# Altium project keycontrol.PrjPCB
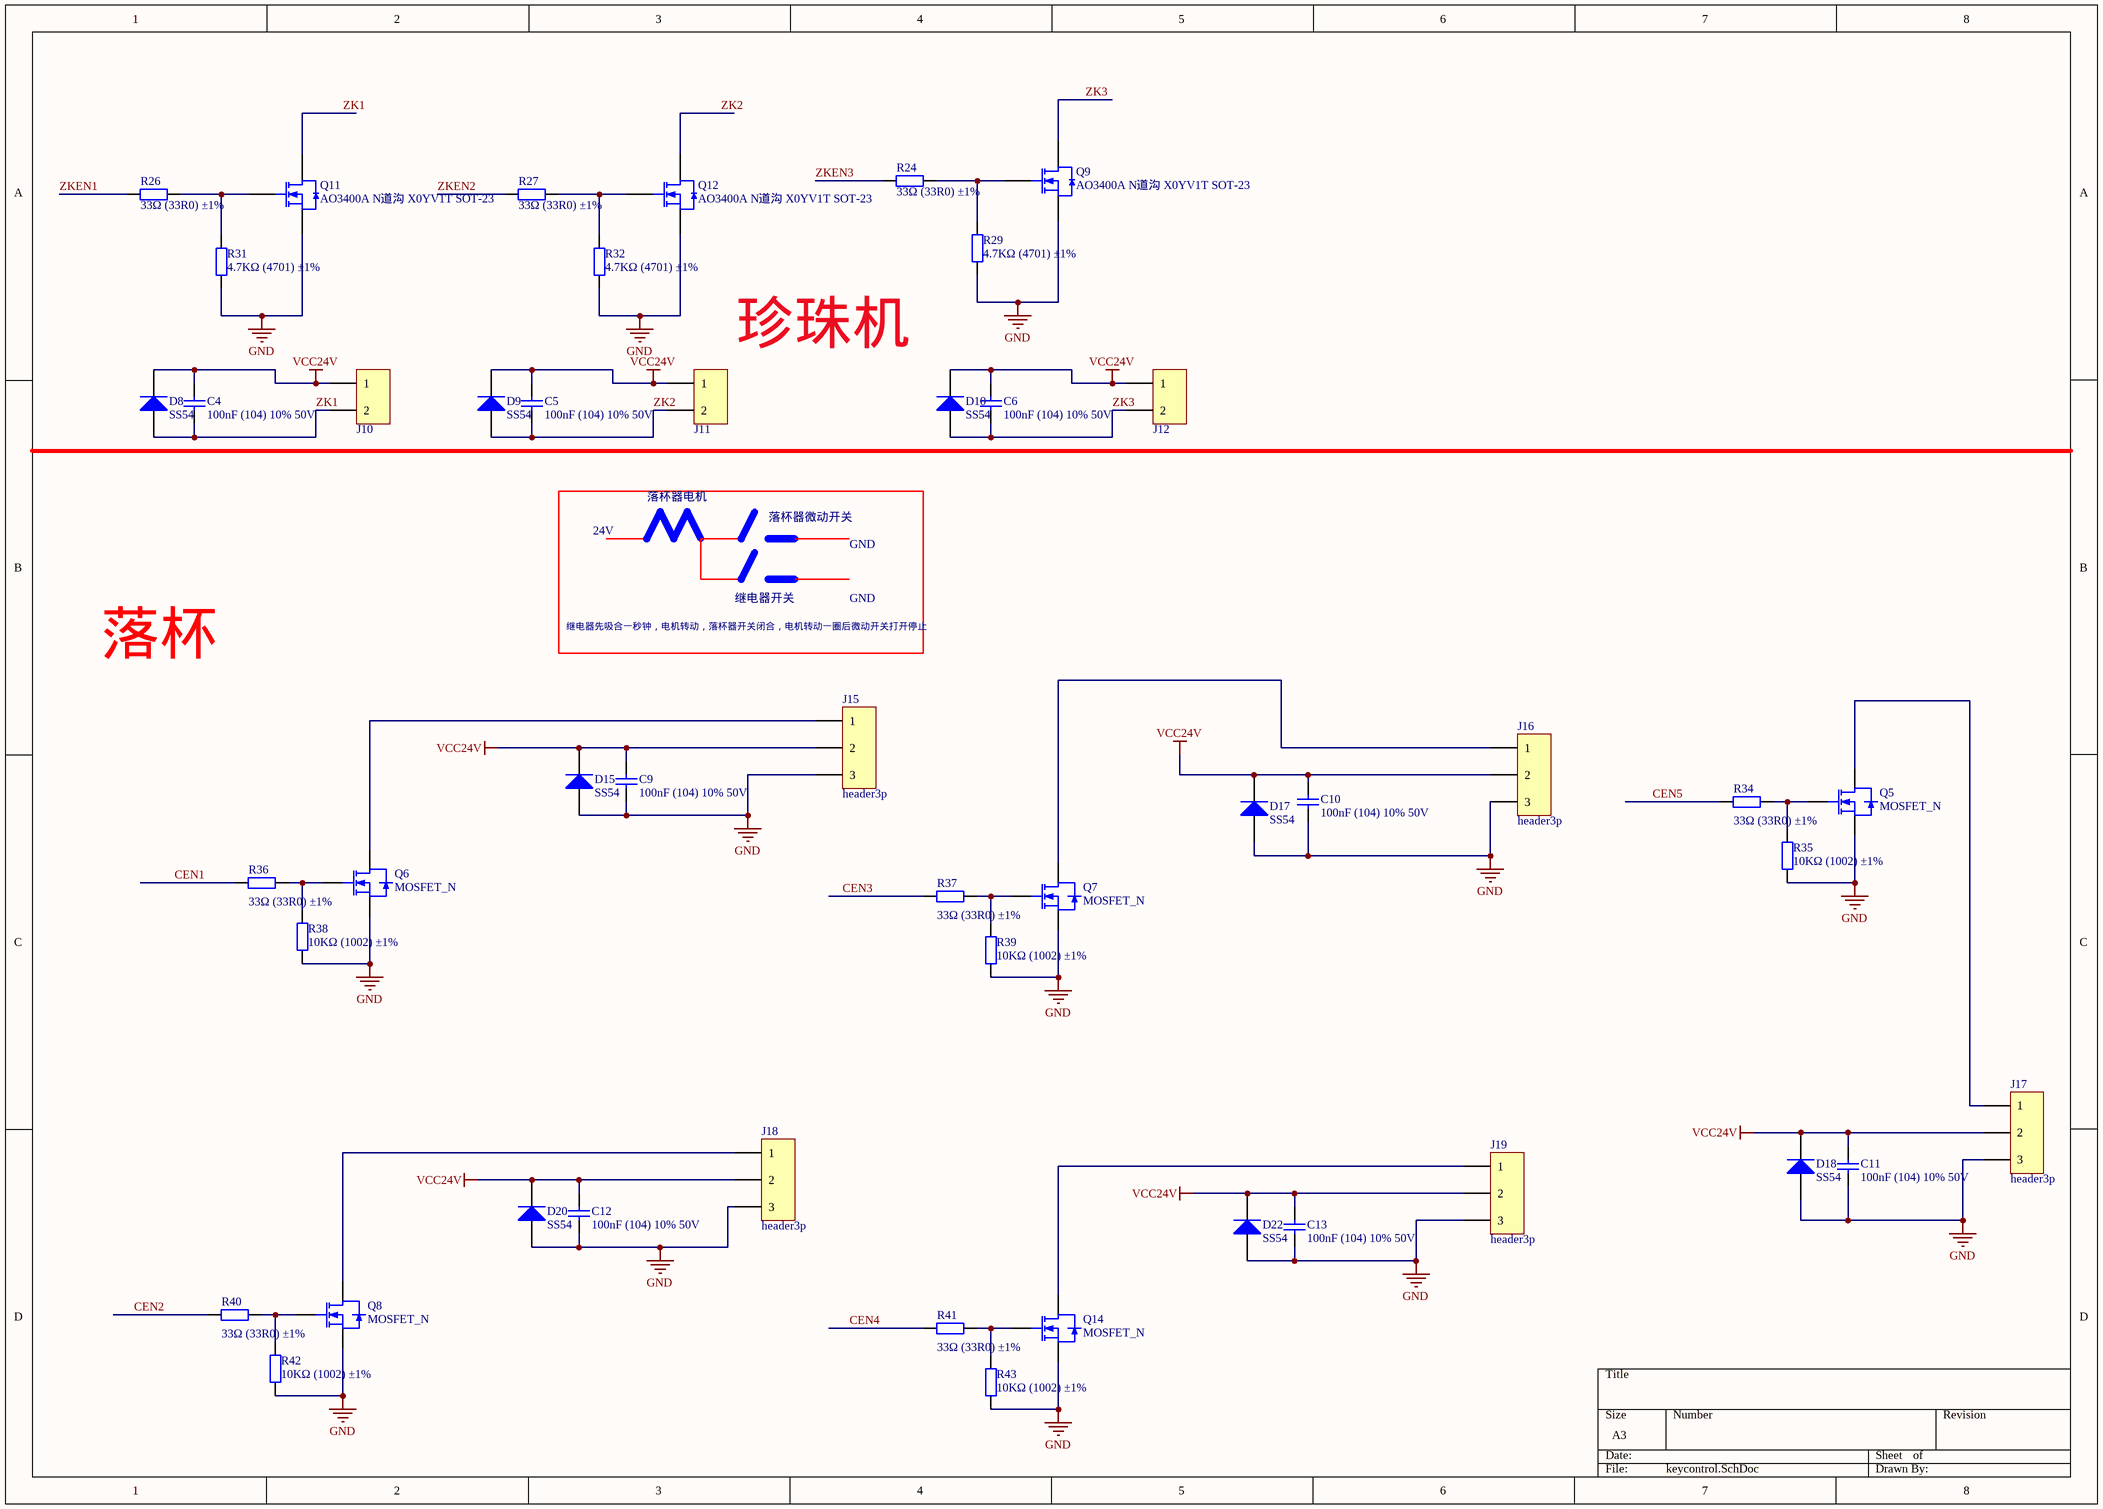
[diagram p0: keycontrol.SchDoc]
4 sheets, 147 parts. Net scope: global (net labels, ports and power ports of the same name join across sheets).
Board file: keycontrol.PcbDoc
Sheets:
  keycontrol.SchDoc
  keycontrol1.SchDoc
  keycontrol2.SchDoc
  keycontrol_MCU.SchDoc

## Sheet keycontrol.SchDoc
size A3

### Parts
C4  100nF (104) 10% 50V  [0603_C]
C5  100nF (104) 10% 50V  [0603_C]
C6  100nF (104) 10% 50V  [0603_C]
C9  100nF (104) 10% 50V  [0603_C]
C10  100nF (104) 10% 50V  [0603_C]
C11  100nF (104) 10% 50V  [0603_C]
C12  100nF (104) 10% 50V  [0603_C]
C13  100nF (104) 10% 50V  [0603_C]
D8  SS54  [SMA(DO-214AC)_S1]
D9  SS54  [SMA(DO-214AC)_S1]
D10  SS54  [SMA(DO-214AC)_S1]
D15  SS54  [SMA(DO-214AC)_S1]
D17  SS54  [SMA(DO-214AC)_S1]
D18  SS54  [SMA(DO-214AC)_S1]
D20  SS54  [SMA(DO-214AC)_S1]
D22  SS54  [SMA(DO-214AC)_S1]
J10  MOTOR  [XH-2P]  (value not drawn)
J11  MOTOR  [XH-2P]  (value not drawn)
J12  MOTOR  [XH-2P]  (value not drawn)
J15  header3p  [XH-3]
J16  header3p  [XH-3]
J17  header3p  [XH-3]
J18  header3p  [XH-3]
J19  header3p  [XH-3]
Q5  MOSFET_N  [TO-252-2]
Q6  MOSFET_N  [TO-252-2]
Q7  MOSFET_N  [TO-252-2]
Q8  MOSFET_N  [TO-252-2]
Q9  AO3400A N道沟 X0YV1T SOT-23  [SOT-23-3L]
Q11  AO3400A N道沟 X0YV1T SOT-23  [SOT-23-3L]
Q12  AO3400A N道沟 X0YV1T SOT-23  [SOT-23-3L]
Q14  MOSFET_N  [TO-252-2]
R24  33Ω (33R0) ±1%  [0603_R]
R26  33Ω (33R0) ±1%  [0603_R]
R27  33Ω (33R0) ±1%  [0603_R]
R29  4.7KΩ (4701) ±1%  [0603_R]
R31  4.7KΩ (4701) ±1%  [0603_R]
R32  4.7KΩ (4701) ±1%  [0603_R]
R34  33Ω (33R0) ±1%  [0603_R]
R35  10KΩ (1002) ±1%  [0603_R]
R36  33Ω (33R0) ±1%  [0603_R]
R37  33Ω (33R0) ±1%  [0603_R]
R38  10KΩ (1002) ±1%  [0603_R]
R39  10KΩ (1002) ±1%  [0603_R]
R40  33Ω (33R0) ±1%  [0603_R]
R41  33Ω (33R0) ±1%  [0603_R]
R42  10KΩ (1002) ±1%  [0603_R]
R43  10KΩ (1002) ±1%  [0603_R]

### Nets
GND: C9.1 C10.1 C11.1 C12.1 C13.1 D15.1(A) D17.1(A) D18.1(A) D20.1(A) D22.1(A) J15.3 J16.3 J17.3 J18.3 J19.3 Q5.3(S) Q6.3(S) Q7.3(S) Q8.3(S) Q9.2(S) Q11.2(S) Q12.2(S) Q14.3(S) R29.1 R31.1 R32.1 R35.1 R38.1 R39.1 R42.1 R43.1
VCC24V: C4.2 C5.2 C6.2 C9.2 C10.2 C11.2 C12.2 C13.2 D8.2(K) D9.2(K) D10.2(K) D15.2(K) D17.2(K) D18.2(K) D20.2(K) D22.2(K) J10.1 J11.1 J12.1 J15.2 J16.2 J17.2 J18.2 J19.2
CEN1: R36.1
CEN2: R40.1
CEN3: R37.1
CEN4: R41.1
CEN5: R34.1
ZK1: C4.1 D8.1(A) J10.2 Q11.3(D)
ZK2: C5.1 D9.1(A) J11.2 Q12.3(D)
ZK3: C6.1 D10.1(A) J12.2 Q9.3(D)
ZKEN1: R26.1
ZKEN2: R27.1
ZKEN3: R24.1
NetJ15_1: J15.1 Q6.2(D)
NetJ16_1: J16.1 Q7.2(D)
NetJ17_1: J17.1 Q5.2(D)
NetJ18_1: J18.1 Q8.2(D)
NetJ19_1: J19.1 Q14.2(D)
NetQ5_1: Q5.1(G) R34.2 R35.2
NetQ6_1: Q6.1(G) R36.2 R38.2
NetQ7_1: Q7.1(G) R37.2 R39.2
NetQ8_1: Q8.1(G) R40.2 R42.2
NetQ9_1: Q9.1(G) R24.2 R29.2
NetQ11_1: Q11.1(G) R26.2 R31.2
NetQ12_1: Q12.1(G) R27.2 R32.2
NetQ14_1: Q14.1(G) R41.2 R43.2

### Notes on the sheet
- 珍珠机
- 落杯器电机
- 24V
- 落杯器微动开关
- GND
- 继电器先吸合一秒钟，电机转动，落杯器开关闭合，电机转动一圈后微动开关打开停止
- 继电器开关
- 落杯

### Library data of the parts
C4-C6 C9-C13 = 0603 100nF (104) 10% 50V: 贴片电容; ComponentLink1Description: 供应商链接; ComponentLink1URL: http://www.szlcsc.com/product/details_15331.html; Package: 0603; Supplier: LC; SuppliersPartNumber: C14663
D8-D10 D15 D17 D18 D20 D22 = SMA(DO-214AC) SS54: 二极管; ComponentLink1Description: 供应商链接; ComponentLink1URL: http://www.szlcsc.com/product/details_23178.html; Package: SMA(DO-214AC); Supplier: LC; SuppliersPartNumber: C22452
J10-J12 = header2
Q9 Q11 Q12 = AO3400A N道沟 X0YV1T SOT-23: MOS(场效应管); ComponentLink1Description: 供应商链接; ComponentLink1URL: http://www.szlcsc.com/product/details_21629.html; Package: SOT-23; Supplier: LC; SuppliersPartNumber: C20917
R24 R26 R27 R34 R36 R37 R40 R41 = 0603 33Ω (33R0) 1%: 贴片电阻; ComponentLink1Description: 供应商链接; ComponentLink1URL: http://www.szlcsc.com/product/details_23867.html; Package: 0603; Supplier: LC; SuppliersPartNumber: C23140
R29 R31 R32 = 0603 4.7KΩ (4701) 1%: 贴片电阻; ComponentLink1Description: 供应商链接; ComponentLink1URL: http://www.szlcsc.com/product/details_23889.html; Package: 0603; Supplier: LC; SuppliersPartNumber: C23162
R35 R38 R39 R42 R43 = 0603 10KΩ (1002) 1%: 贴片电阻; ComponentLink1Description: 供应商链接; ComponentLink1URL: http://www.szlcsc.com/product/details_26547.html; Package: 0603; Supplier: LC; SuppliersPartNumber: C25804

## Sheet keycontrol1.SchDoc
size A3
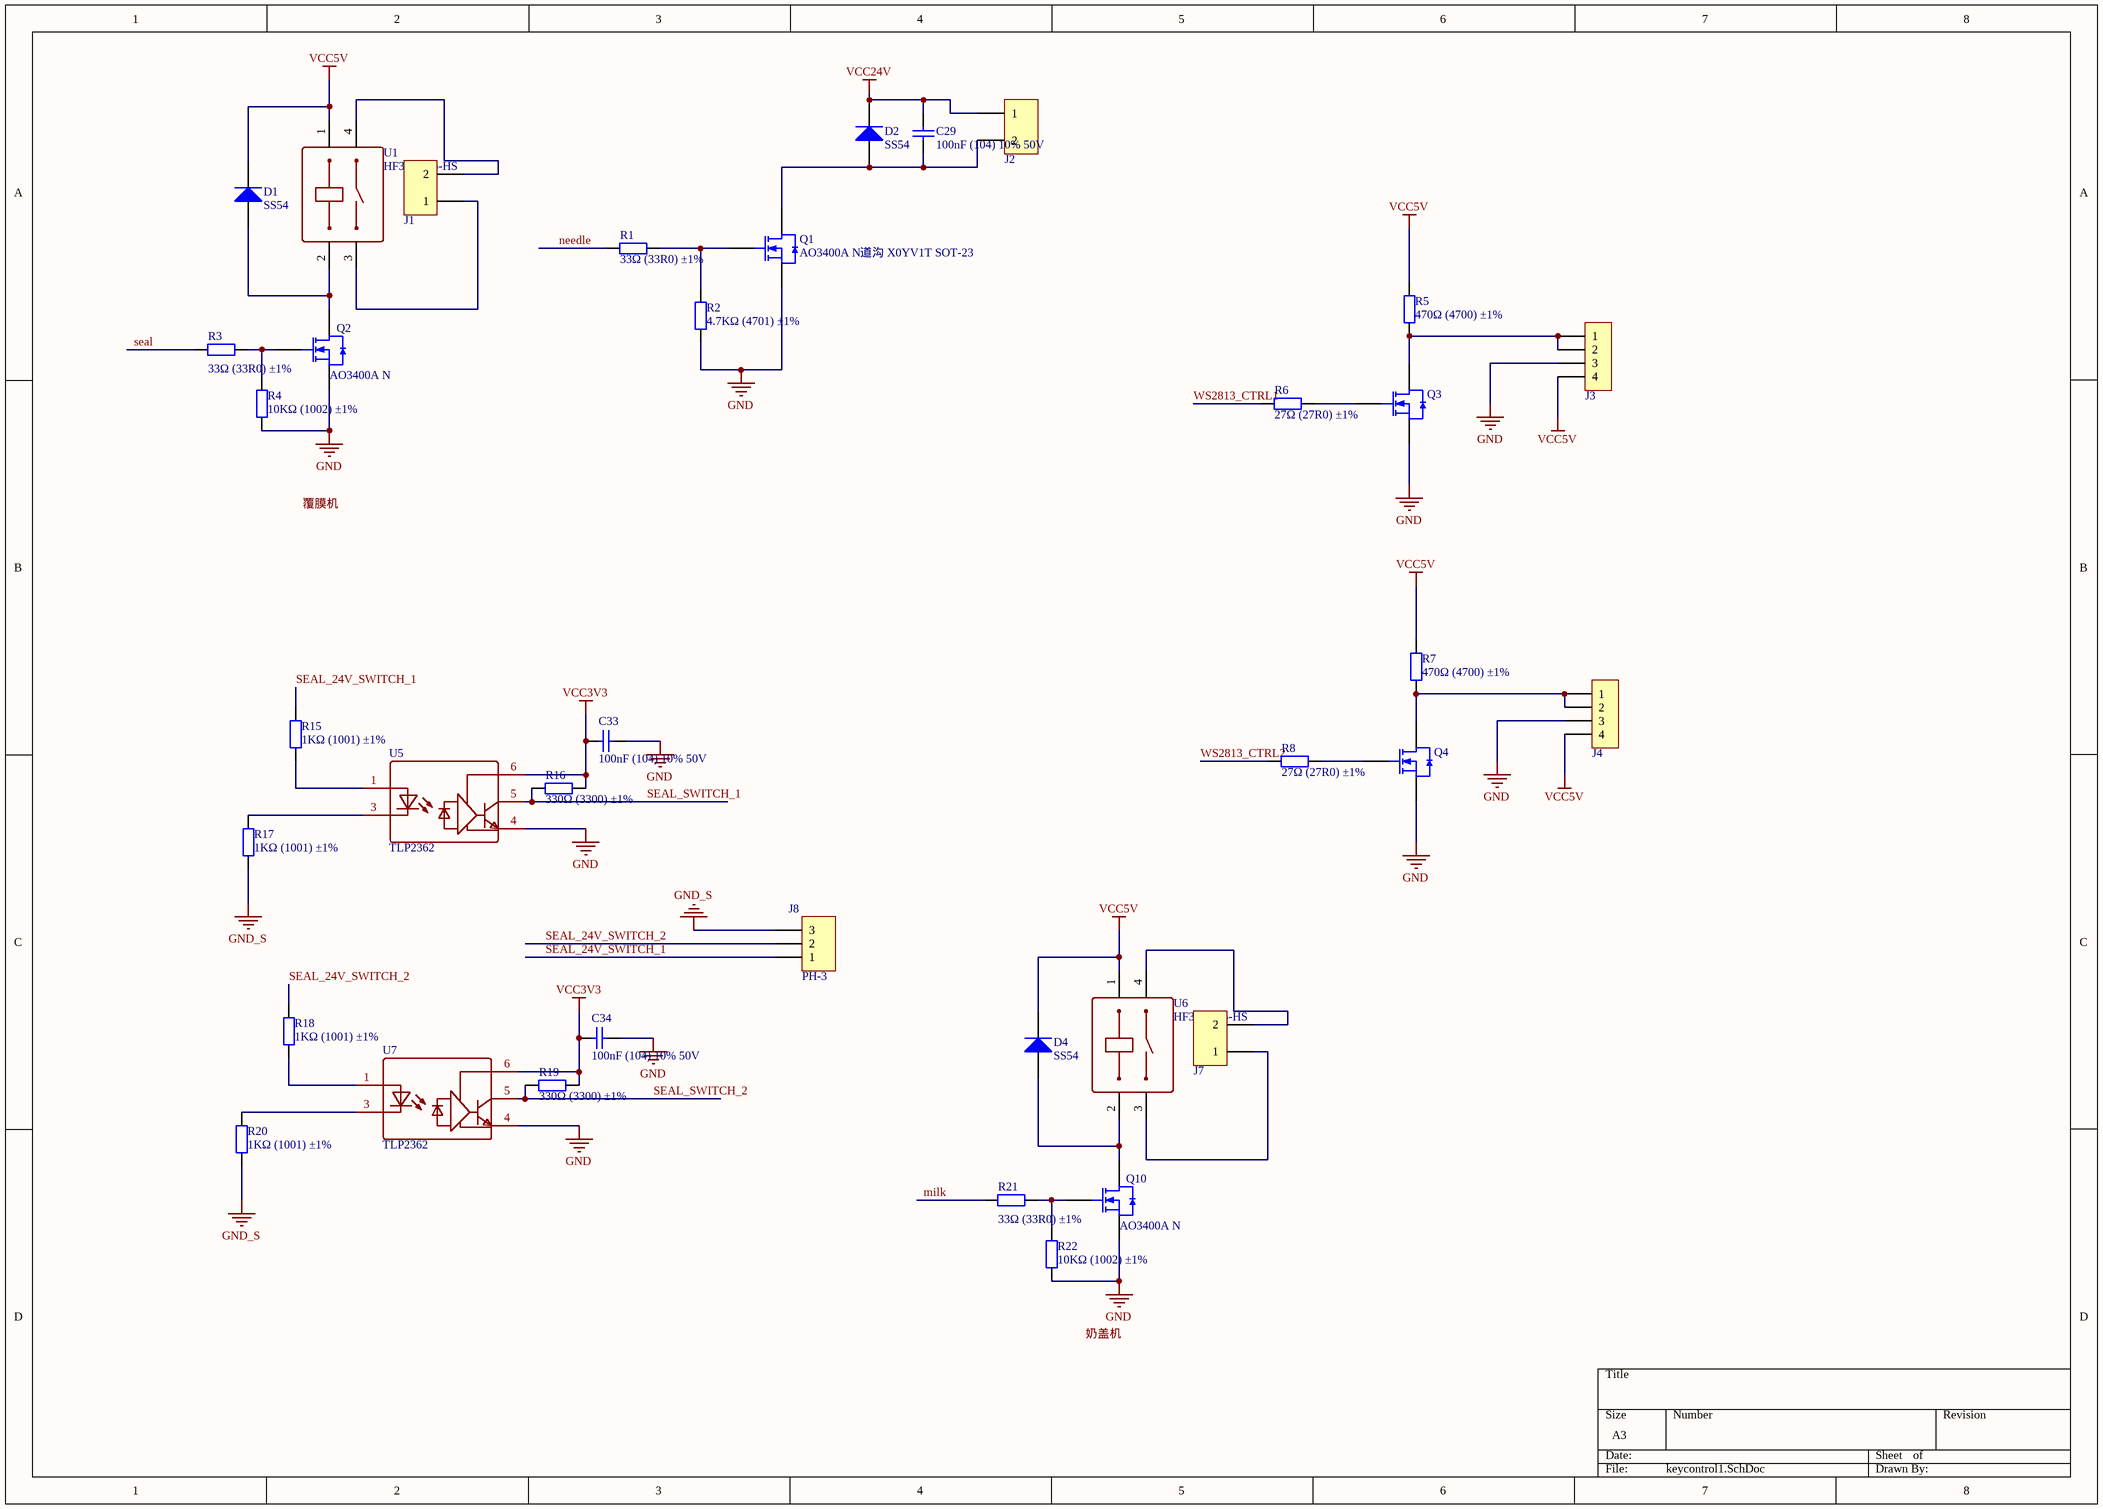
[diagram p1: keycontrol1.SchDoc]

### Parts
C29  100nF (104) 10% 50V  [0603_C]
C33  100nF (104) 10% 50V  [0603_C]
C34  100nF (104) 10% 50V  [0603_C]
D1  SS54  [SMA(DO-214AC)_S1]
D2  SS54  [SMA(DO-214AC)_S1]
D4  SS54  [SMA(DO-214AC)_S1]
J1  MOTOR  [PH2-2.0]  (value not drawn)
J2  MOTOR  [XH-2P]  (value not drawn)
J3  header4  [xh-4]  (value not drawn)
J4  header4  [xh-4]  (value not drawn)
J7  MOTOR  [PH2-2.0]  (value not drawn)
J8  PH-3  [ph3-2.0]
Q1  AO3400A N道沟 X0YV1T SOT-23  [SOT-23-3L]
Q2  AO3400A N  [SOT-23-3L]
Q3  AO3400A N道沟 X0YV1T SOT-23  [SOT-23-3L]  (value not drawn)
Q4  AO3400A N道沟 X0YV1T SOT-23  [SOT-23-3L]  (value not drawn)
Q10  AO3400A N  [SOT-23-3L]
R1  33Ω (33R0) ±1%  [0603_R]
R2  4.7KΩ (4701) ±1%  [0603_R]
R3  33Ω (33R0) ±1%  [0603_R]
R4  10KΩ (1002) ±1%  [0603_R]
R5  470Ω (4700) ±1%  [0603_R]
R6  27Ω (27R0) ±1%  [0603_R]
R7  470Ω (4700) ±1%  [0603_R]
R8  27Ω (27R0) ±1%  [0603_R]
R15  1KΩ (1001) ±1%  [1206_R]
R16  330Ω (3300) ±1%  [0603_R]
R17  1KΩ (1001) ±1%  [1206_R]
R18  1KΩ (1001) ±1%  [1206_R]
R19  330Ω (3300) ±1%  [0603_R]
R20  1KΩ (1001) ±1%  [1206_R]
R21  33Ω (33R0) ±1%  [0603_R]
R22  10KΩ (1002) ±1%  [0603_R]
U1  HF32F/005-HS  [HF32F/005-HS]
U5  TLP2362  [SO-5]
U6  HF32F/005-HS  [HF32F/005-HS]
U7  TLP2362  [SO-5]

### Nets
GND: C33.2 C34.2 J3.3 J4.3 Q1.2(S) Q2.2(S) Q3.2(S) Q4.2(S) Q10.2(S) R2.1 R4.1 R22.1 U5.4 U7.4
GND_S: J8.3 R17.1 R20.1
VCC3V3: C33.1 C34.1 R16.2 R19.2 U5.6 U7.6
VCC5V: D1.2(K) D4.2(K) J3.4 J4.4 R5.2 R7.2 U1.1 U6.1
VCC24V: C29.2 D2.2(K) J2.1
milk: R21.1
needle: R1.1
seal: R3.1
SEAL_24V_SWITCH_1: J8.1 R15.2
SEAL_24V_SWITCH_2: J8.2 R18.2
SEAL_SWITCH_1: R16.1 U5.5
SEAL_SWITCH_2: R19.1 U7.5
WS2813_CTRL1: R6.1
WS2813_CTRL2: R8.1
NetC29_1: C29.1 D2.1(A) J2.2 Q1.3(D)
NetD1_1: D1.1(A) Q2.3(D) U1.2
NetD4_1: D4.1(A) Q10.3(D) U6.2
NetJ1_1: J1.1 U1.3
NetJ1_2: J1.2 U1.4
NetJ3_1: J3.1 J3.2 Q3.3(D) R5.1
NetJ4_1: J4.1 J4.2 Q4.3(D) R7.1
NetJ7_1: J7.1 U6.3
NetJ7_2: J7.2 U6.4
NetQ1_1: Q1.1(G) R1.2 R2.2
NetQ2_1: Q2.1(G) R3.2 R4.2
NetQ3_1: Q3.1(G) R6.2
NetQ4_1: Q4.1(G) R8.2
NetQ10_1: Q10.1(G) R21.2 R22.2
NetR15_1: R15.1 U5.1
NetR17_2: R17.2 U5.3
NetR18_1: R18.1 U7.1
NetR20_2: R20.2 U7.3

### Notes on the sheet
- Labels drawn without touching a wire or pin: 奶盖机, 覆膜机

### Library data of the parts
C29 C33 C34 = 0603 100nF (104) 10% 50V: 贴片电容; ComponentLink1Description: 供应商链接; ComponentLink1URL: http://www.szlcsc.com/product/details_15331.html; Package: 0603; Supplier: LC; SuppliersPartNumber: C14663
D1 D2 D4 = SMA(DO-214AC) SS54: 二极管; ComponentLink1Description: 供应商链接; ComponentLink1URL: http://www.szlcsc.com/product/details_23178.html; Package: SMA(DO-214AC); Supplier: LC; SuppliersPartNumber: C22452
J1 J2 J7 = header2
J8 = XH-3
Q1-Q4 Q10 = AO3400A N道沟 X0YV1T SOT-23: MOS(场效应管); ComponentLink1Description: 供应商链接; ComponentLink1URL: http://www.szlcsc.com/product/details_21629.html; Package: SOT-23; Supplier: LC; SuppliersPartNumber: C20917
R1 R3 R21 = 0603 33Ω (33R0) 1%: 贴片电阻; ComponentLink1Description: 供应商链接; ComponentLink1URL: http://www.szlcsc.com/product/details_23867.html; Package: 0603; Supplier: LC; SuppliersPartNumber: C23140
R2 = 0603 4.7KΩ (4701) 1%: 贴片电阻; ComponentLink1Description: 供应商链接; ComponentLink1URL: http://www.szlcsc.com/product/details_23889.html; Package: 0603; Supplier: LC; SuppliersPartNumber: C23162
R4 R22 = 0603 10KΩ (1002) 1%: 贴片电阻; ComponentLink1Description: 供应商链接; ComponentLink1URL: http://www.szlcsc.com/product/details_26547.html; Package: 0603; Supplier: LC; SuppliersPartNumber: C25804
R5 R7 = 0603 470Ω (4700) 1%: 贴片电阻; ComponentLink1Description: 供应商链接; ComponentLink1URL: http://www.szlcsc.com/product/details_23906.html; Package: 0603; Supplier: LC; SuppliersPartNumber: C23179
R6 R8 = 0603 27Ω (27R0) 1%: 贴片电阻; ComponentLink1Description: 供应商链接; ComponentLink1URL: http://www.szlcsc.com/product/details_25933.html; Package: 0603; Supplier: LC; SuppliersPartNumber: C25190
R15 R17 R18 R20 = 1206 1KΩ (1001) 1%: 贴片电阻; ComponentLink1Description: 供应商链接; ComponentLink1URL: http://www.szlcsc.com/product/details_4817.html; Package: 1206; Supplier: LC; SuppliersPartNumber: C4410
R16 R19 = 0603 330Ω (3300) 1%: 贴片电阻; ComponentLink1Description: 供应商链接; ComponentLink1URL: http://www.szlcsc.com/product/details_23865.html; Package: 0603; Supplier: LC; SuppliersPartNumber: C23138
U1 U6 = HF32F/005-HS: 继电器

## Sheet keycontrol2.SchDoc
size A4
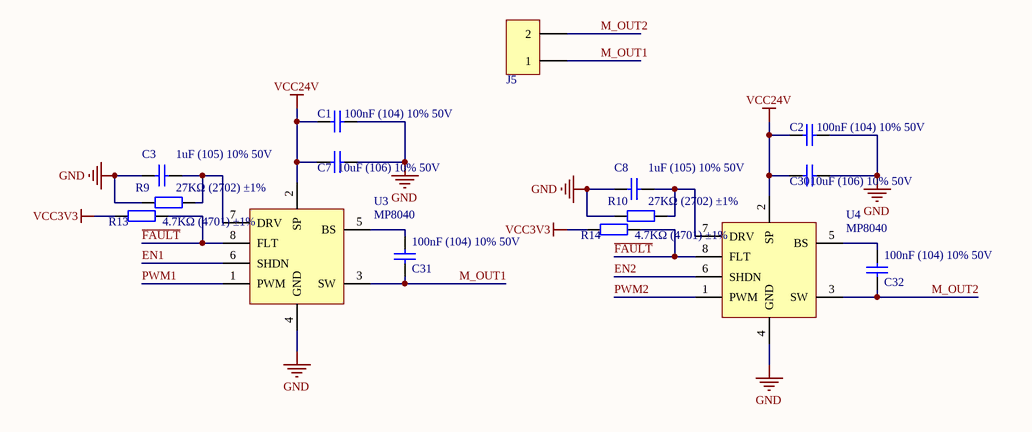
[diagram p2: keycontrol2.SchDoc]

### Parts
C1  100nF (104) 10% 50V  [0603_C]
C2  100nF (104) 10% 50V  [0603_C]
C3  1uF (105) 10% 50V  [0603_C]
C7  10uF (106) 10% 50V  [1206_C]
C8  1uF (105) 10% 50V  [0603_C]
C30  10uF (106) 10% 50V  [1206_C]
C31  100nF (104) 10% 50V  [0603_C]
C32  100nF (104) 10% 50V  [0603_C]
J5  MOTOR  [XH-2P]  (value not drawn)
R9  27KΩ (2702) ±1%  [0603_R]
R10  27KΩ (2702) ±1%  [0603_R]
R13  4.7KΩ (4701) ±1%  [0603_R]
R14  4.7KΩ (4701) ±1%  [0603_R]
U3  MP8040  [SOIC-8_150mil]
U4  MP8040  [SOIC-8_150mil]

### Nets
GND: C1.1 C2.1 C3.1 C7.2 C8.1 C30.2 R9.1 R10.1 U3.4(GND) U4.4(GND)
VCC3V3: R13.1 R14.1
VCC24V: C1.2 C2.2 C7.1 C30.1 U3.2(SP) U4.2(SP)
EN1: U3.6(SHDN)
EN2: U4.6(SHDN)
~{FAULT}: R13.2 R14.2 U3.8(FLT) U4.8(FLT)
M_OUT1: C31.1 J5.1 U3.3(SW)
M_OUT2: C32.1 J5.2 U4.3(SW)
PWM1: U3.1(PWM)
PWM2: U4.1(PWM)
NetC3_2: C3.2 R9.2 U3.7(DRV)
NetC8_2: C8.2 R10.2 U4.7(DRV)
NetC31_2: C31.2 U3.5(BS)
NetC32_2: C32.2 U4.5(BS)

### Library data of the parts
C1 C2 C31 C32 = 0603 100nF (104) 10% 50V: 贴片电容; ComponentLink1Description: 供应商链接; ComponentLink1URL: http://www.szlcsc.com/product/details_15331.html; Package: 0603; Supplier: LC; SuppliersPartNumber: C14663
C3 C8 = 0603 1uF (105) 10% 50V: 贴片电容; ComponentLink1Description: 供应商链接; ComponentLink1URL: http://www.szlcsc.com/product/details_16531.html; Package: 0603; Supplier: LC; SuppliersPartNumber: C15849
C7 C30 = 1206 10uF (106) 10% 50V: 贴片电容; ComponentLink1Description: 供应商链接; ComponentLink1URL: http://www.szlcsc.com/product/details_14236.html; Package: 1206; Supplier: LC; SuppliersPartNumber: C13585
J5 = header2
R9 R10 = 0603 27KΩ (2702) 1%: 贴片电阻; ComponentLink1Description: 供应商链接; ComponentLink1URL: http://www.szlcsc.com/product/details_23694.html; Package: 0603; Supplier: LC; SuppliersPartNumber: C22967
R13 R14 = 0603 4.7KΩ (4701) 1%: 贴片电阻; ComponentLink1Description: 供应商链接; ComponentLink1URL: http://www.szlcsc.com/product/details_23889.html; Package: 0603; Supplier: LC; SuppliersPartNumber: C23162
U3 U4 = MP8040DN-LF-Z: half bridge power driver

## Sheet keycontrol_MCU.SchDoc
size A3
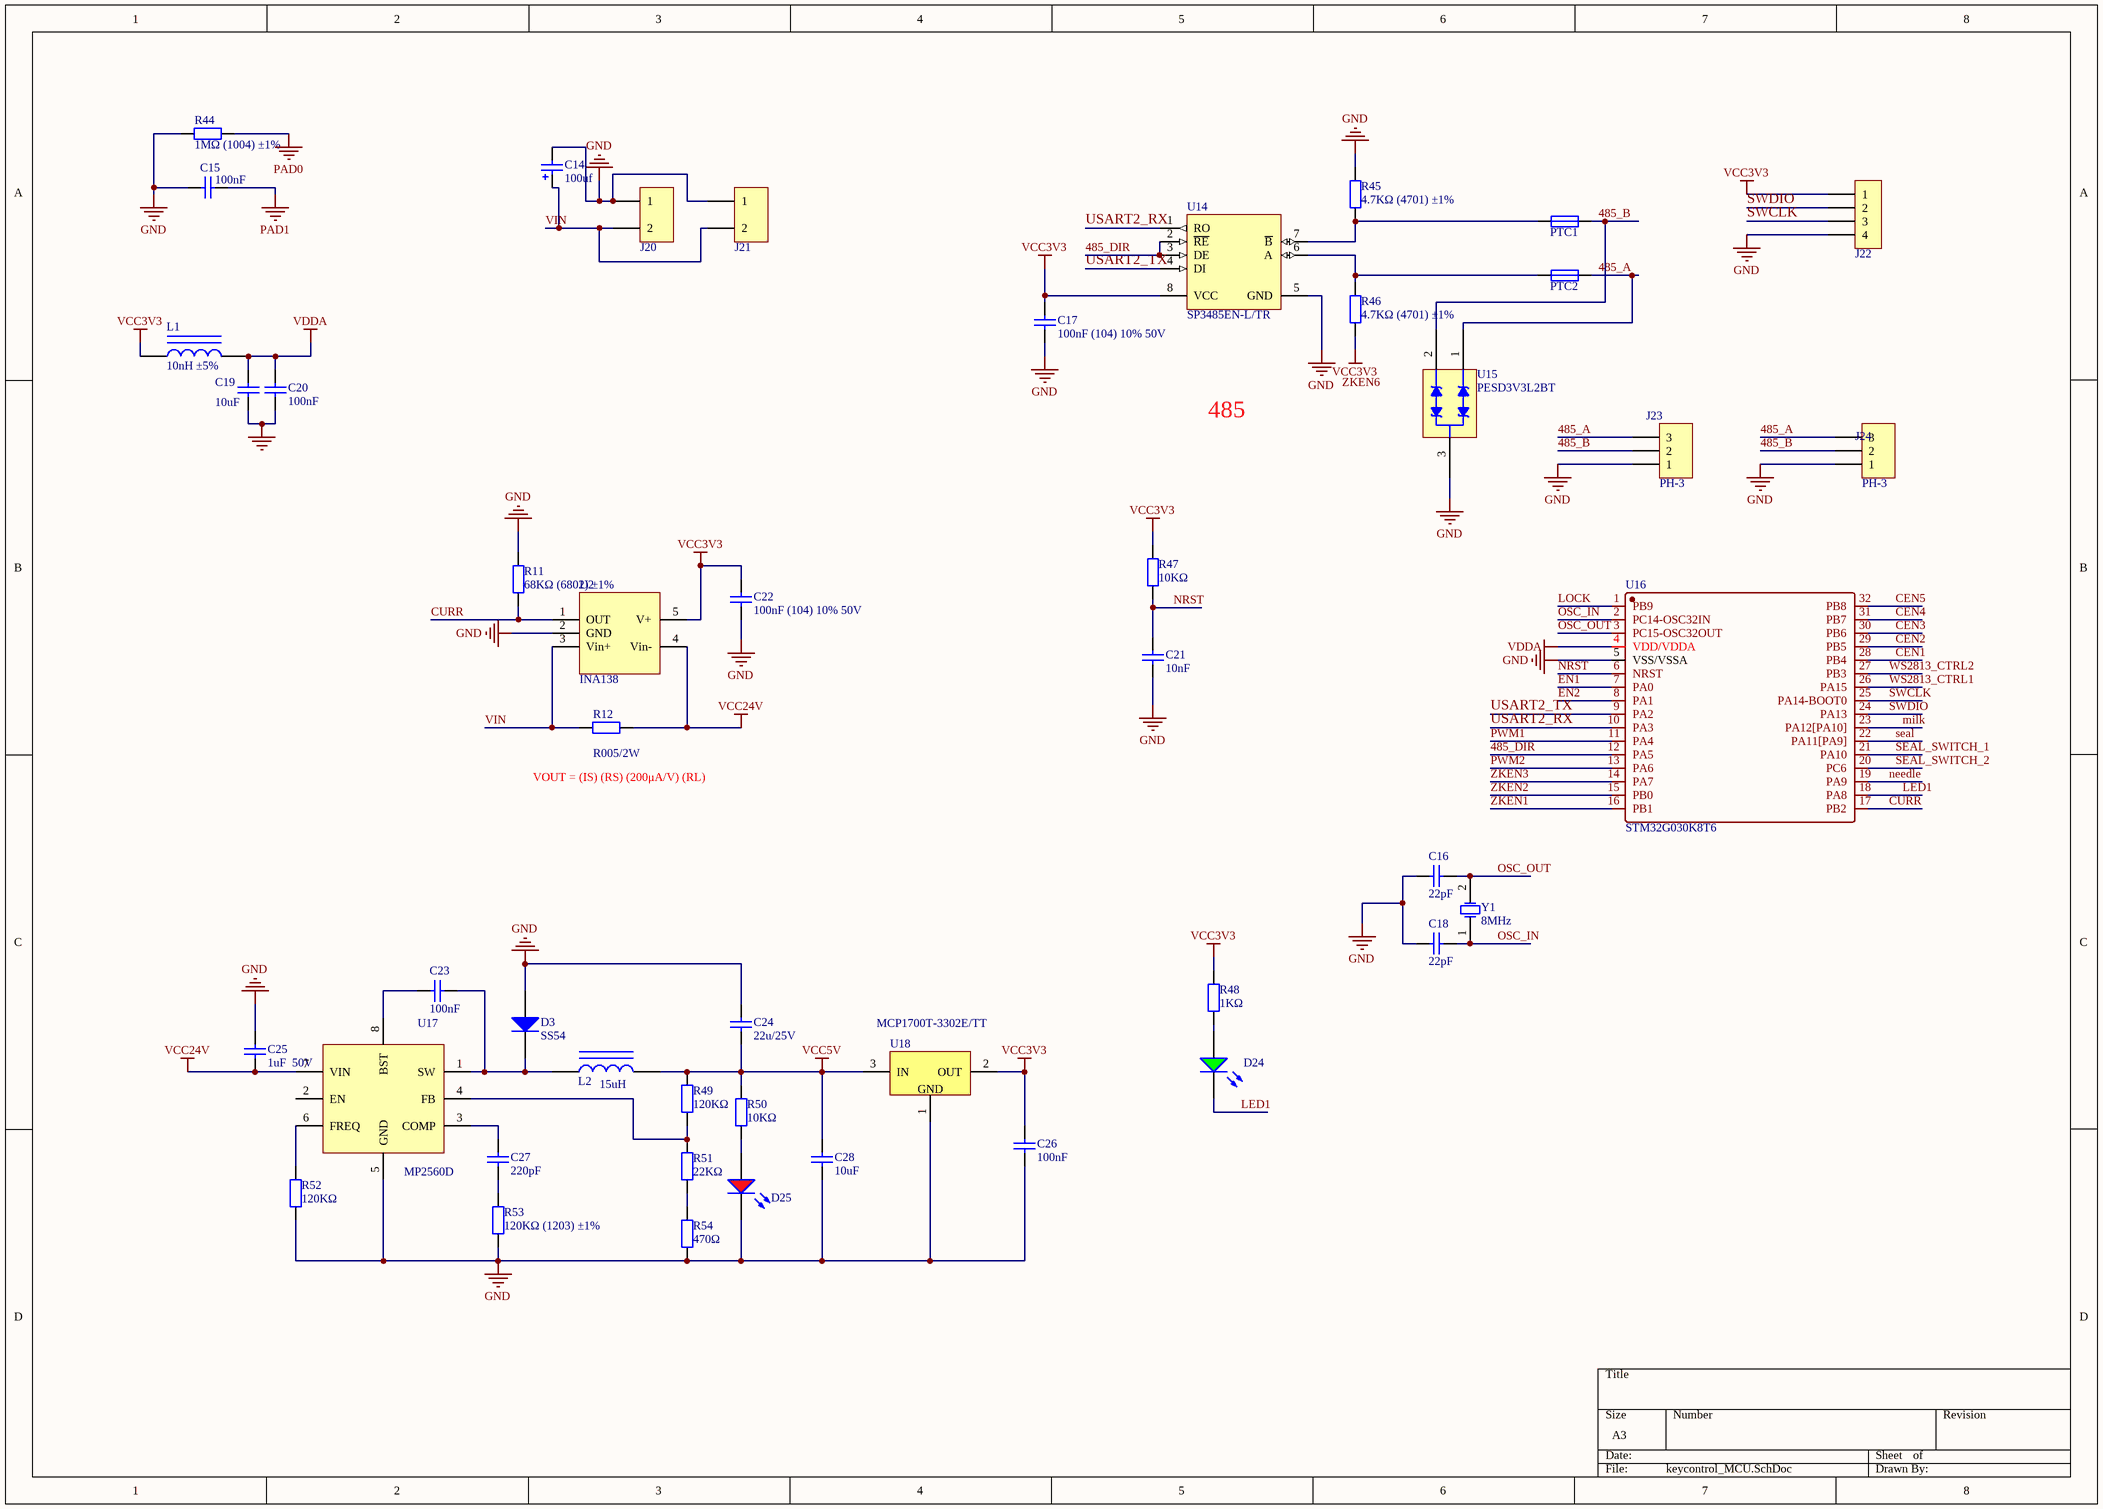
[diagram p3: keycontrol_MCU.SchDoc]

### Parts
C14  100uf  [E_6.3*5.4]
C15  100nF  [0603_C]
C16  22pF  [0603_C]
C17  100nF (104) 10% 50V  [0603_C]
C18  22pF  [0603_C]
C19  10uF  [0603_C]
C20  100nF  [0603_C]
C21  10nF  [0603_C]
C22  100nF (104) 10% 50V  [0603_C]
C23  100nF  [0603_C]
C24  22u/25V  [1206_C]
C25  1uF  50V  [0603_C]
C26  100nF  [0603_C]
C27  220pF  [0603_C]
C28  10uF  [0603_C]
D3  SS54  [SMA(DO-214AC)_S1]
D24  绿灯 0603  [0603_LED_S1]  (value not drawn)
D25  红灯 0603  [0603_LED_S1]  (value not drawn)
J20  MOTOR  [5557_a]  (value not drawn)
J21  MOTOR  [5557_a]  (value not drawn)
J22  header4  [xh-4]  (value not drawn)
J23  PH-3  [ph3-2.0]
J24  PH-3  [ph3-2.0]
L1  10nH ±5%  [0603_L]
L2  15uH  [LSMD,3.3*6.6*3mm]
PTC1  PTC  [PTC]  (value not drawn)
PTC2  PTC  [PTC]  (value not drawn)
R11  68KΩ (6802) ±1%  [0603_R]
R12  R005/2W  [2512]
R44  1MΩ (1004) ±1%  [0603_R]
R45  4.7KΩ (4701) ±1%  [0603_R]
R46  4.7KΩ (4701) ±1%  [0603_R]
R47  10KΩ  [0603_R]
R48  1KΩ  [0603_R]
R49  120KΩ  [0603_R]
R50  10KΩ  [0603_R]
R51  22KΩ  [0603_R]
R52  120KΩ  [0603_R]
R53  120KΩ (1203) ±1%  [0603_R]
R54  470Ω  [0603_R]
U2  INA138  [SOT-23-5]
U14  SP3485EN-L/TR  [SOIC-8_150mil]
U15  PESD3V3L2BT  [SOT-23(SOT-23-3)]
U16  STM32G030K8T6  [LQFP-32]
U17  MP2560D  [SOP-8_150mil]
U18  MCP1700T-3302E/TT  [SOT-23-3]
Y1  8MHz  [SMD-5032_2P]

### Nets
GND: C14.2 C15.1 C16.1 C17.1 C18.1 C19.1 C20.1 C21.1 C22.1 C24.2 C25.2 C26.1 C28.1 D3.1(A) D25.K J20.1 J21.1 J22.4 J23.1 J24.1 R11.2 R44.1 R45.2 R52.1 R53.2 R54.1 U2.2(GND) U14.5(GND) U15.3 U16.5(VSS/VSSA) U17.5(GND) U18.1
PAD0: R44.2
PAD1: C15.2
VCC3V3: C17.2 C22.2 C26.2 J22.1 L1.1 R46.1 R47.2 R48.2 U2.5(V+) U14.8(VCC) U18.2(OUT)
VCC5V: C24.1 C28.2 L2.2 R49.1 R50.2 U18.3(IN)
VCC24V: C25.1 R12.2 U2.4(Vin-) U17.7(VIN)
VDDA: C19.2 C20.2 L1.2 U16.4(VDD/VDDA)
485_A: J23.3 J24.3 PTC2.2 U15.1
485_B: J23.2 J24.2 PTC1.2 U15.2
485_DIR: U14.2(~{RE}) U14.3(DE) U16.12(PA5)
CEN1: U16.28(PB4)
CEN2: U16.29(PB5)
CEN3: U16.30(PB6)
CEN4: U16.31(PB7)
CEN5: U16.32(PB8)
CURR: R11.1 U2.1(OUT) U16.17(PB2)
EN1: U16.7(PA0)
EN2: U16.8(PA1)
LED1: D24.K U16.18(PA8)
LOCK: U16.1(PB9)
milk: U16.23(PA12[PA10])
needle: U16.19(PA9)
NRST: C21.2 R47.1 U16.6(NRST)
OSC_IN: C18.2 U16.2(PC14-OSC32IN) Y1.1(OSC1)
OSC_OUT: C16.2 U16.3(PC15-OSC32OUT) Y1.2(OSC2)
PWM1: U16.11(PA4)
PWM2: U16.13(PA6)
seal: U16.22(PA11[PA9])
SEAL_SWITCH_1: U16.21(PA10)
SEAL_SWITCH_2: U16.20(PC6)
SWCLK: J22.3 U16.25(PA14-BOOT0)
SWDIO: J22.2 U16.24(PA13)
USART2_RX: U14.1(RO) U16.10(PA3)
USART2_TX: U14.4(DI) U16.9(PA2)
VIN: C14.1 J20.2 J21.2 R12.1 U2.3(Vin+)
WS2813_CTRL1: U16.26(PA15)
WS2813_CTRL2: U16.27(PB3)
ZKEN1: U16.16(PB1)
ZKEN2: U16.15(PB0)
ZKEN3: U16.14(PA7)
NetC23_1: C23.1 U17.8(BST)
NetC23_2: C23.2 D3.2(K) L2.1 U17.1(SW)
NetC27_1: C27.1 R53.1
NetC27_2: C27.2 U17.3(COMP)
NetD24_A: D24.A R48.1
NetD25_A: D25.A R50.1
NetPTC1_1: PTC1.1 R45.1 U14.7(~{B})
NetPTC2_1: PTC2.1 R46.2 U14.6(A)
NetR49_2: R49.2 R51.2 U17.4(FB)
NetR51_1: R51.1 R54.2
NetR52_2: R52.2 U17.6(FREQ)

Not connected (* = marked no-connect by the designer): U17 2(EN)

### Notes on the sheet
- 485
- (near R12) VOUT = (IS) (RS) (200μA/V) (RL)
- Labels drawn without touching a wire or pin: ZKEN6
- (in symbol MCP1700T-3302E/TT LDO 3.3V) GND /

### Library data of the parts
C14 = C
C15 C17 C20 C22 C23 C26 = 0603 100nF (104) 10% 50V: 贴片电容; ComponentLink1Description: 供应商链接; ComponentLink1URL: http://www.szlcsc.com/product/details_15331.html; Package: 0603; Supplier: LC; SuppliersPartNumber: C14663
C16 C18 = 0603 22pF (220) 5% 50V: 贴片电容; ComponentLink1Description: 供应商链接; ComponentLink1URL: http://www.szlcsc.com/product/details_2005.html; Package: 0603; Supplier: LC; SuppliersPartNumber: C1653
C19 C28 = 0603 10uF (106) 10% 10V: 贴片电容; ComponentLink1Description: 供应商链接; ComponentLink1URL: http://www.szlcsc.com/product/details_20411.html; Package: 0603; Supplier: LC; SuppliersPartNumber: C19702
C21 = 0603 10nF (103) 10% 50V: 贴片电容; ComponentLink1Description: 供应商链接; ComponentLink1URL: http://www.szlcsc.com/product/details_58143.html; Package: 0603; Supplier: LC; SuppliersPartNumber: C57112
C24 = 1206 220pF (221) 10% 50V: 贴片电容; ComponentLink1Description: 供应商链接; ComponentLink1URL: http://www.szlcsc.com/product/details_2206.html; Package: 1206; Supplier: LC; SuppliersPartNumber: C1854
C25 = 0603 1uF (105) 10% 50V: 贴片电容; ComponentLink1Description: 供应商链接; ComponentLink1URL: http://www.szlcsc.com/product/details_16531.html; Package: 0603; Supplier: LC; SuppliersPartNumber: C15849
C27 = 0603 220pF (221) 10% 50V: 贴片电容; ComponentLink1Description: 供应商链接; ComponentLink1URL: http://www.szlcsc.com/product/details_1955.html; Package: 0603; Supplier: LC; SuppliersPartNumber: C1603
D3 = SMA(DO-214AC) SS54: 二极管; ComponentLink1Description: 供应商链接; ComponentLink1URL: http://www.szlcsc.com/product/details_23178.html; Package: SMA(DO-214AC); Supplier: LC; SuppliersPartNumber: C22452
D24 = 0603 绿灯: 发光二极管; ComponentLink1Description: 供应商链接; ComponentLink1URL: http://www.szlcsc.com/product/details_73152.html; Package: 0603; Supplier: LC; SuppliersPartNumber: C72043
D25 = 0603 红灯: 发光二极管; ComponentLink1Description: 供应商链接; ComponentLink1URL: http://www.szlcsc.com/product/details_2659.html; Package: 0603; Supplier: LC; SuppliersPartNumber: C2286
J20 J21 = header2
J23 J24 = XH-3
L1 = 0603 10nH 5%: 贴片电感; ComponentLink1Description: 供应商链接; ComponentLink1URL: http://www.szlcsc.com/product/details_16347.html; Package: 0603; Supplier: LC; SuppliersPartNumber: C15666
L2 = induct: YSPI0730-150M
R11 = 0603 68KΩ (6802) 1%: 贴片电阻; ComponentLink1Description: 供应商链接; ComponentLink1URL: http://www.szlcsc.com/product/details_23958.html; Package: 0603; Supplier: LC; SuppliersPartNumber: C23231
R12 = RES
R44 = 0603 1MΩ (1004) 1%: 贴片电阻; ComponentLink1Description: 供应商链接; ComponentLink1URL: http://www.szlcsc.com/product/details_23662.html; Package: 0603; Supplier: LC; SuppliersPartNumber: C22935
R45 R46 = 0603 4.7KΩ (4701) 1%: 贴片电阻; ComponentLink1Description: 供应商链接; ComponentLink1URL: http://www.szlcsc.com/product/details_23889.html; Package: 0603; Supplier: LC; SuppliersPartNumber: C23162
R47 R50 = 0603 10KΩ (1002) 1%: 贴片电阻; ComponentLink1Description: 供应商链接; ComponentLink1URL: http://www.szlcsc.com/product/details_26547.html; Package: 0603; Supplier: LC; SuppliersPartNumber: C25804
R48 = 0603 1KΩ (1001) 1%: 贴片电阻; ComponentLink1Description: 供应商链接; ComponentLink1URL: http://www.szlcsc.com/product/details_21904.html; Package: 0603; Supplier: LC; SuppliersPartNumber: C21190
R49 R52 R53 = 0603 120KΩ (1203) 1%: 贴片电阻; ComponentLink1Description: 供应商链接; ComponentLink1URL: http://www.szlcsc.com/product/details_26551.html; Package: 0603; Supplier: LC; SuppliersPartNumber: C25808
R51 = 0603 22KΩ (2202) 1%: 贴片电阻; ComponentLink1Description: 供应商链接; ComponentLink1URL: http://www.szlcsc.com/product/details_32812.html; Package: 0603; Supplier: LC; SuppliersPartNumber: C31850
R54 = 0603 470Ω (4700) 1%: 贴片电阻; ComponentLink1Description: 供应商链接; ComponentLink1URL: http://www.szlcsc.com/product/details_23906.html; Package: 0603; Supplier: LC; SuppliersPartNumber: C23179
U2 = INA138: SOT-23-5
U14 = SP3485EN-L/TR_[C8963]: RS-485/RS-422; ComponentLink1Description: 供应商链接; ComponentLink1URL: http://www.szlcsc.com/product/details_9482.html; Package: SOIC-8; Supplier: LC; SuppliersPartNumber: C8963
U15 = PSM712-LF-T7_[C32677]: TVS; ComponentLink1Description: 供应商链接; ComponentLink1URL: http://www.szlcsc.com/product/details_33642.html; Package: SOT-23(SOT-23-3); Supplier: LC; SuppliersPartNumber: C32677
U16 = STM32G030K8T6: MCU
U17 = MP2560D: MP2560D_SOIC-8_EP_150mil
U18 = MCP1700T-3302E/TT LDO 3.3V: https://item.szlcsc.com/40034.html LDO 3.3V
Y1 = SMD-5032_2P 8MHz 20ppm 20pF: 贴片晶振; ComponentLink1Description: 供应商链接; ComponentLink1URL: http://www.szlcsc.com/product/details_117214.html; Package: SMD-5032_2P; Supplier: LC; SuppliersPartNumber: C115962

## Nets that join several sheets
GND: keycontrol (31 pins), keycontrol1 (14 pins), keycontrol2 (10 pins), keycontrol_MCU (32 pins)
VCC3V3: keycontrol1 (6 pins), keycontrol2 (R13.1 R14.1), keycontrol_MCU (11 pins)
VCC5V: keycontrol1 (8 pins), keycontrol_MCU (6 pins)
VCC24V: keycontrol (24 pins), keycontrol1 (C29.2 D2.2 J2.1), keycontrol2 (6 pins), keycontrol_MCU (C25.1 R12.2 U2.4 U17.7)
CEN1: keycontrol (R36.1), keycontrol_MCU (U16.28)
CEN2: keycontrol (R40.1), keycontrol_MCU (U16.29)
CEN3: keycontrol (R37.1), keycontrol_MCU (U16.30)
CEN4: keycontrol (R41.1), keycontrol_MCU (U16.31)
CEN5: keycontrol (R34.1), keycontrol_MCU (U16.32)
EN1: keycontrol2 (U3.6), keycontrol_MCU (U16.7)
EN2: keycontrol2 (U4.6), keycontrol_MCU (U16.8)
milk: keycontrol1 (R21.1), keycontrol_MCU (U16.23)
needle: keycontrol1 (R1.1), keycontrol_MCU (U16.19)
PWM1: keycontrol2 (U3.1), keycontrol_MCU (U16.11)
PWM2: keycontrol2 (U4.1), keycontrol_MCU (U16.13)
seal: keycontrol1 (R3.1), keycontrol_MCU (U16.22)
SEAL_SWITCH_1: keycontrol1 (R16.1 U5.5), keycontrol_MCU (U16.21)
SEAL_SWITCH_2: keycontrol1 (R19.1 U7.5), keycontrol_MCU (U16.20)
WS2813_CTRL1: keycontrol1 (R6.1), keycontrol_MCU (U16.26)
WS2813_CTRL2: keycontrol1 (R8.1), keycontrol_MCU (U16.27)
ZKEN1: keycontrol (R26.1), keycontrol_MCU (U16.16)
ZKEN2: keycontrol (R27.1), keycontrol_MCU (U16.15)
ZKEN3: keycontrol (R24.1), keycontrol_MCU (U16.14)